# Altium schematic sheet SystemRCP_Maciej.Jazłowiecki.SchDoc
size A4; SheetNumber: 1; SheetTotal: 1; SPICEModelCacheVIDJEAVR: <root> / <DocumentId>VIDJEAVR</DocumentId> / <CacheFrame Number="0"> / <Model Name="led1" Kind="MDL"> / <Text>*Typ RED GaAs LED: Vf=1.7V Vr=4V If=40mA trr=3uS / *LED Pinout: 1=A, 2=K / .MODEL LED1 D (IS=93.2P RS=42M N=3.73 BV=4 IBV=10U / + CJO=2.97P VJ=.75 M=.333 TT=4.32U)</Text> / </Model> / </CacheFrame> / </root>
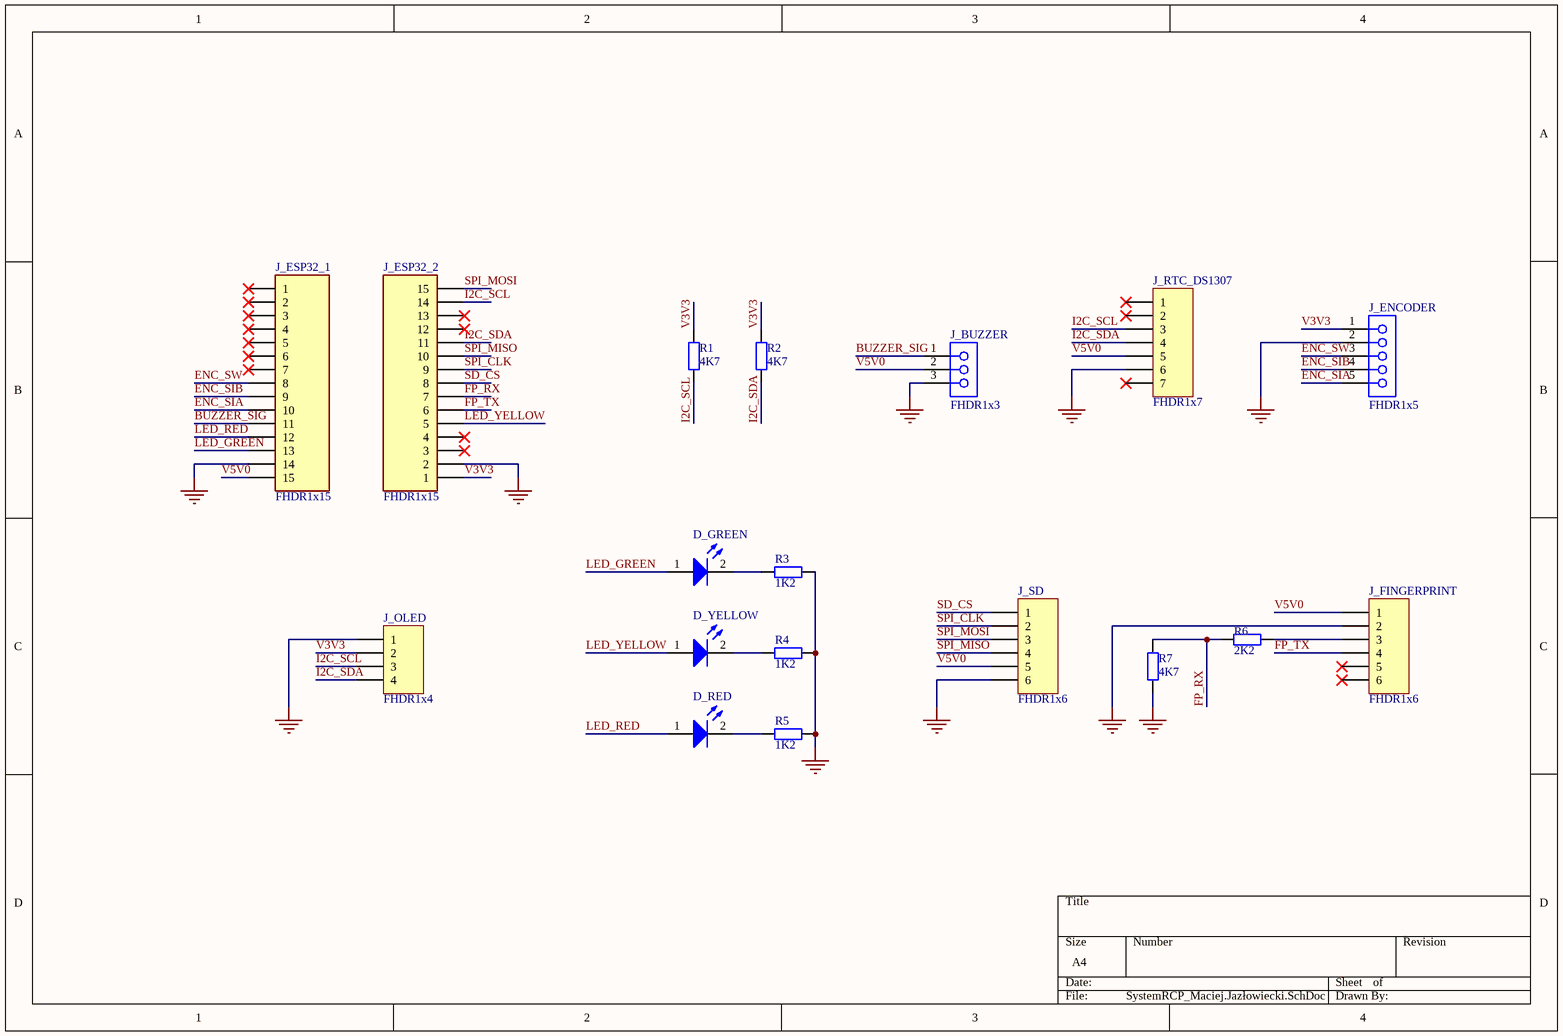
[diagram p0: SystemRCP_Maciej.Jazłowiecki.SchDoc]

## Parts
D_GREEN  LED_GREEN  [LED-1]  (value not drawn)
D_RED  LED1  [LED-1]  (value not drawn)
D_YELLOW  LED1  [LED-1]  (value not drawn)
J_BUZZER  FHDR1x3  [61300311821]
J_ENCODER  FHDR1x5  [61300511821]
J_ESP32_1  FHDR1x15  [HDR1X15]
J_ESP32_2  FHDR1x15  [HDR1X15]
J_FINGERPRINT  FHDR1x6  [HDR1X6]
J_OLED  FHDR1x4  [HDR1X4]
J_RTC_DS1307  FHDR1x7  [HDR1X7]
J_SD  FHDR1x6  [HDR1X6]
R1  value 4K7  [AXIAL-0.4]  (hidden comment: Res2)
R2  value 4K7  [AXIAL-0.4]  (hidden comment: Res2)
R3  value 1K2  [AXIAL-0.4]  (hidden comment: Res2)
R4  value 1K2  [AXIAL-0.4]  (hidden comment: Res2)
R5  value 1K2  [AXIAL-0.4]  (hidden comment: Res2)
R6  value 2K2  [AXIAL-0.4]  (hidden comment: Res2)
R7  value 4K7  [AXIAL-0.4]  (hidden comment: Res2)

## Nets
GND: J_BUZZER.3 J_ENCODER.2 J_ESP32_1.14 J_ESP32_2.2 J_FINGERPRINT.2 J_OLED.1 J_RTC_DS1307.6 J_SD.6 R3.1 R4.1 R5.1 R7.1
BUZZER_SIG: J_BUZZER.1 J_ESP32_1.11
ENC_SIA: J_ENCODER.5 J_ESP32_1.10
ENC_SIB: J_ENCODER.4 J_ESP32_1.9
ENC_SW: J_ENCODER.3 J_ESP32_1.8
FP_RX: J_ESP32_2.7 R6.2 R7.2
FP_TX: J_ESP32_2.6 J_FINGERPRINT.4
I2C_SCL: J_ESP32_2.14 J_OLED.3 J_RTC_DS1307.3 R1.1
I2C_SDA: J_ESP32_2.11 J_OLED.4 J_RTC_DS1307.4 R2.1
LED_GREEN: D_GREEN.1(A) J_ESP32_1.13
LED_RED: D_RED.1(A) J_ESP32_1.12
LED_YELLOW: D_YELLOW.1(A) J_ESP32_2.5
SD_CS: J_ESP32_2.8 J_SD.1
SPI_CLK: J_ESP32_2.9 J_SD.2
SPI_MISO: J_ESP32_2.10 J_SD.4
SPI_MOSI: J_ESP32_2.15 J_SD.3
V3V3: J_ENCODER.1 J_ESP32_2.1 J_OLED.2 R1.2 R2.2
V5V0: J_BUZZER.2 J_ESP32_1.15 J_FINGERPRINT.1 J_RTC_DS1307.5 J_SD.5
NetD_GREEN_2: D_GREEN.2(K) R3.2
NetD_RED_2: D_RED.2(K) R5.2
NetD_YELLOW_2: D_YELLOW.2(K) R4.2
NetJ_FINGERPRINT_3: J_FINGERPRINT.3 R6.1

Not connected (* = marked no-connect by the designer): J_ESP32_1 1* 2* 3* 4* 5* 6* 7*; J_ESP32_2 3* 4* 12* 13*; J_FINGERPRINT 5* 6*; J_RTC_DS1307 1* 2* 7*

## Library data of the parts
D_GREEN D_RED D_YELLOW = LED1: Typical RED GaAs LED; Published: 8-Jun-2000; LatestRevisionDate: 08-Jul-2005; LatestRevisionNote: Mech Layer 1 removed.; PackageReference: LED-1; Publisher: Altium Limited; PackageDescription: LED; 2 Leads
J_BUZZER = CMP-1502-01315-4: Btb Conn, Rcpt, 3Pos, 1Row, 2.54Mm Rohs Compliant: Yes; Current Rating: 3A; Operating Supply Voltage: 250V; Contact Resistance: 20mΩ; Gender: Female; Number of Pins: 3; Lead Pitch: 2.54mm; RoHS: Non-Compliant; Orientation: Vertical
J_ENCODER = CMP-1502-01320-4: THT Vertical Socket Header WR-PHD, Pitch 2.54 mm, Single Row, 5 pins; Gender: Female; Contact Resistance: 20mΩ; Operating Supply Voltage: 250V; Current Rating: 3A; Number of Pins: 5; Lead Pitch: 2.54mm; Orientation: Vertical
J_ESP32_1 J_ESP32_2 = 315-83-115-41-003101: 15 Position Socket Connector 0.100" (2.54mm) Through Hole Gold; Manufacturer_Name: Preci-Dip; Geometry.Height: 2.41mm; Mouser Part Number: *; Mouser Price/Stock: *; Manufacturer_Part_Number: 315-83-115-41-003101; Datasheet Link: https://www.precidip.com/pview/315-PP-1NN-41-003101.html?hkey=EF798316E3902B6ED9A73243A3159BB0
J_FINGERPRINT J_SD = Header 6: Header, 6-Pin; LatestRevisionDate: 17-Jul-2002; LatestRevisionNote: Re-released for DXP Platform.; Publisher: Altium Limited
J_OLED = Header 4: Header, 4-Pin; LatestRevisionDate: 17-Jul-2002; LatestRevisionNote: Re-released for DXP Platform.; Publisher: Altium Limited
J_RTC_DS1307 = Header 7: Header, 7-Pin; LatestRevisionDate: 17-Jul-2002; LatestRevisionNote: Re-released for DXP Platform.; Publisher: Altium Limited
R1-R7 = Res2: Resistor; Published: 8-Jun-2000; LatestRevisionDate: 17-Jul-2002; LatestRevisionNote: Re-released for DXP Platform.; PackageReference: AXIAL-0.4; Publisher: Altium Limited; PackageDescription: Axial Device, Thru-Hole; 2 Leads; 0.4 in Pin Spacing